# EAGLE design 6502_arduino (EAGLE 9.6.2)
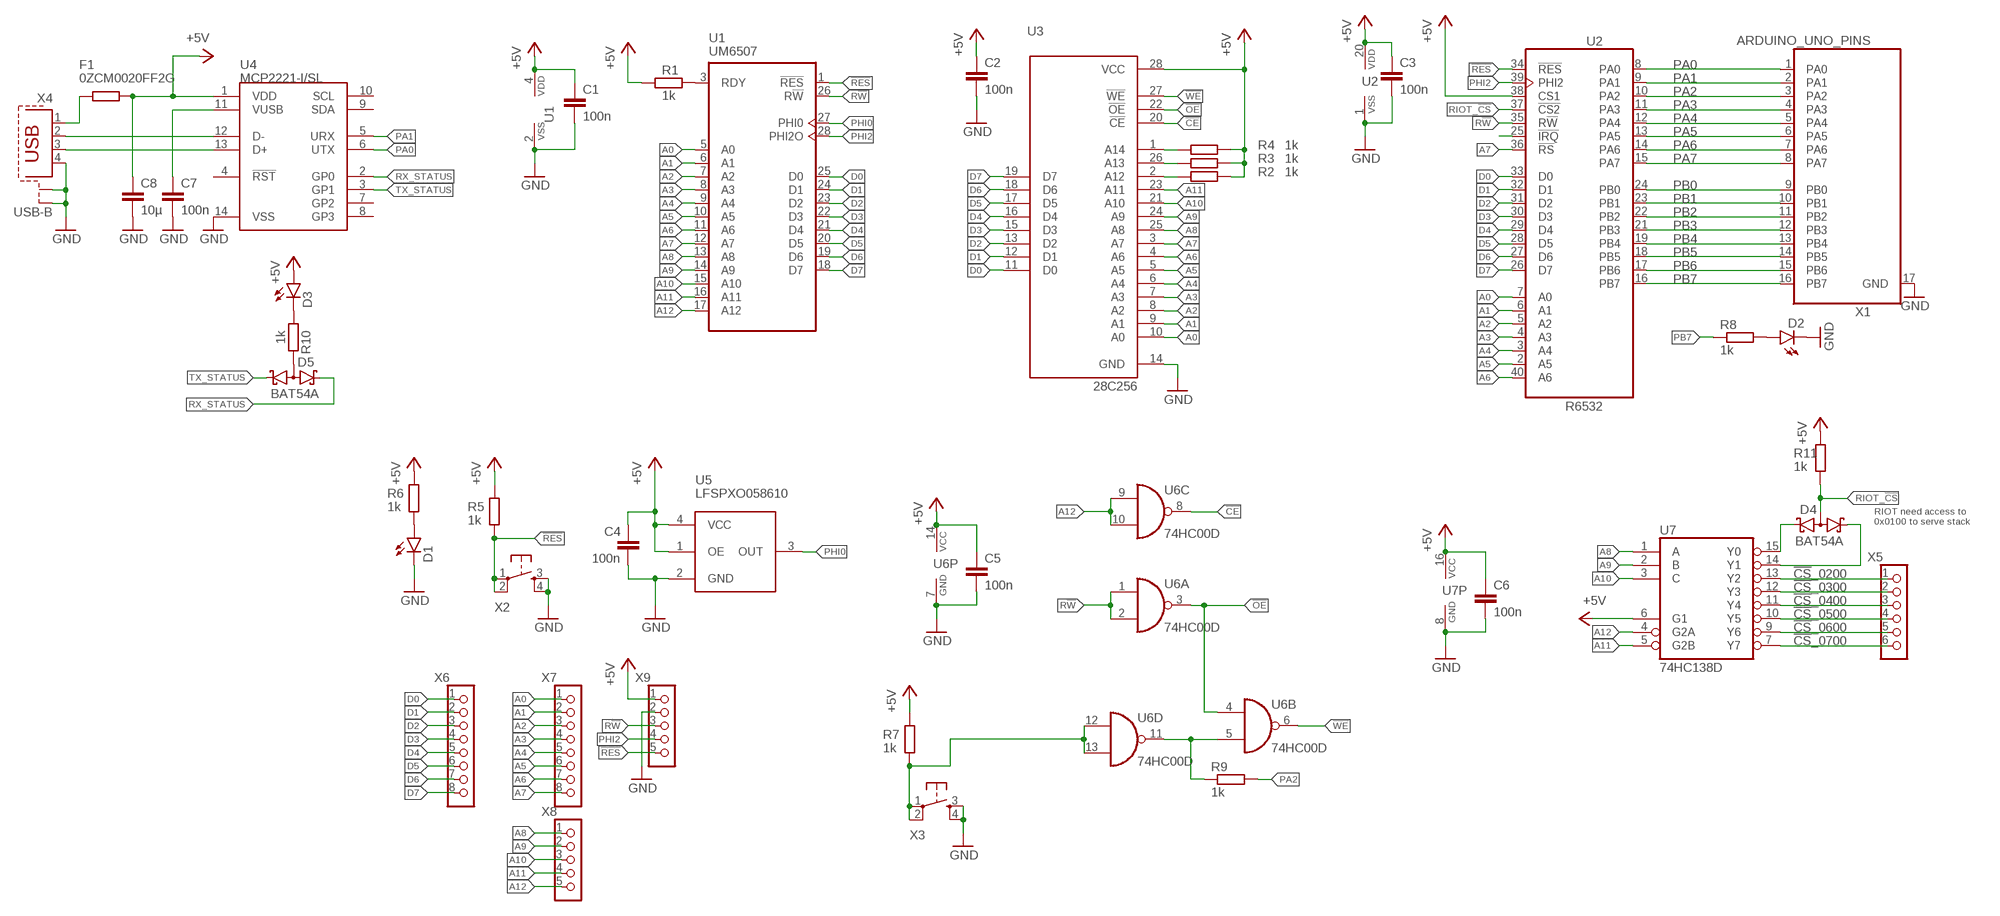
[diagram p0: schematic, sheet 1]

## Parts
C1  100n  C0805  [C0805]
C2  100n  C0805  [C0805]
C3  100n  C0805  [C0805]
C4  100n  C0805  [C0805]
C5  100n  C0805  [C0805]
C6  100n  C0805  [C0805]
C7  100n  C0805  [C0805]
C8  10µ  C0805  [C0805]
D1  LED  [LED3MM]
D2  LED  [LED3MM]
D3  LED  [LED3MM]
D4  BAT54A  [SOT23]
D5  BAT54A  [SOT23]
F1  0ZCM0020FF2G  R-EU_R0603  [R0603]
R1  1k  R0805  [R0805]
R2  1k  R0805  [R0805]
R3  1k  R0805  [R0805]
R4  1k  R0805  [R0805]
R5  1k  R0805  [R0805]
R6  1k  R0805  [R0805]
R7  1k  R0805  [R0805]
R8  1k  R0805  [R0805]
R9  1k  R0805  [R0805]
R10  1k  R0805  [R0805]
R11  1k  R0805  [R0805]
U1  UM6507  [DIL28-6]
U2  R6532  [DIL40]
U3  28C256  [DIL28-6]
U4  MCP2221-I/SL  [SOIC14]
U5  LFSPXO058610  [LFSPXO058610]
U6  74HC00D  [SO14]
U7  74HC138D  [SO16]
X1  ARDUINO_UNO_PINS  [ARDUINO_R3]
X2  TACT_SWITCH  [TACTILE_SWITCH_PTH_6.0MM]
X3  TACT_SWITCH  [TACTILE_SWITCH_PTH_6.0MM]
X4  USB-B  [PN61729-S]
X5  PINHD_6_RND  [1X06]
X6  PINHD_8_RND  [1X08]
X7  PINHD_8_RND  [1X08]
X8  PINHD_5_RND  [1X05]
X9  PINHD_5_RND  [1X05]

## Nets
!BOOT: R7.1 U6.12(D:I0) U6.13(D:I1) X3.1 X3.2
!CE: U3.20(!CE) U6.8(C:O)
!CS!_0200: U7.13(Y2) X5.1
!CS!_0300: U7.12(Y3) X5.2
!CS!_0400: U7.11(Y4) X5.3
!CS!_0500: U7.10(Y5) X5.4
!CS!_0600: U7.9(Y6) X5.5
!CS!_0700: U7.7(Y7) X5.6
!OE: U3.22(!OE) U6.3(A:O) U6.4(B:I0)
!RES: R5.1 U1.1(!RES) U2.34(!RES) X2.1 X2.2 X9.5
!WE: U3.27(!WE) U6.6(B:O)
+5V: C1.1 C2.1 C3.1 C4.1 C5.1 C6.1 C8.1 D3.A F1.2 R1.1 R2.2 R3.2 R4.2 R5.2 R6.2 R7.2 R11.2 U1.4(VDD) U2.20(VDD) U2.38(CS1) U3.28(VCC) U4.1(VDD) U5.1(OE) U5.4(VCC) U6.14(P:VCC) U7.6(G1) U7.16(VCC) X9.1
A0: U1.5(A0) U2.7(A0) U3.10(A0) X7.1
A1: U1.6(A1) U2.6(A1) U3.9(A1) X7.2
A2: U1.7(A2) U2.5(A2) U3.8(A2) X7.3
A3: U1.8(A3) U2.4(A3) U3.7(A3) X7.4
A4: U1.9(A4) U2.3(A4) U3.6(A4) X7.5
A5: U1.10(A5) U2.2(A5) U3.5(A5) X7.6
A6: U1.11(A6) U2.40(A6) U3.4(A6) X7.7
A7: U1.12(A7) U2.36(!RS) U3.3(A7) X7.8
A8: U1.13(A8) U3.25(A8) U7.1(A) X8.1
A9: U1.14(A9) U3.24(A9) U7.2(B) X8.2
A10: U1.15(A10) U3.21(A10) U7.3(C) X8.3
A11: U1.16(A11) U3.23(A11) U7.5(G2B) X8.4
A12: U1.17(A12) U6.9(C:I0) U6.10(C:I1) U7.4(G2A) X8.5
D0: U1.25(D0) U2.33(D0) U3.11(D0) X6.1
D1: U1.24(D1) U2.32(D1) U3.12(D1) X6.2
D2: U1.23(D2) U2.31(D2) U3.13(D2) X6.3
D3: U1.22(D3) U2.30(D3) U3.15(D3) X6.4
D4: U1.21(D4) U2.29(D4) U3.16(D4) X6.5
D5: U1.20(D5) U2.28(D5) U3.17(D5) X6.6
D6: U1.19(D6) U2.27(D6) U3.18(D6) X6.7
D7: U1.18(D7) U2.26(D7) U3.19(D7) X6.8
GND: C1.2 C2.2 C3.2 C4.2 C5.2 C6.2 C7.2 C8.2 D1.K(C) D2.K(C) U1.2(VSS) U2.1(VSS) U3.14(GND) U4.14(VSS) U5.2(GND) U6.7(P:GND) U7.8(GND) X1.17(GND) X2.3 X2.4 X3.3 X3.4 X4.4 X4.S1 X4.S2 X9.2
N$1: R1.2 U1.3(RDY)
N$2: D1.A R6.1
N$3: R9.1 U6.5(B:I1) U6.11(D:O)
N$4: D2.A R8.2
N$5: U4.12(D-) X4.2
N$6: U4.13(D+) X4.3
N$7: U2.25(!IRQ)
N$8: D3.K(C) R10.1
N$9: C7.1 U4.11(VUSB)
N$10: D5.3(AA) R10.2
N$11: F1.1 X4.1
N$13: D4.1(K1) U7.15(Y0)
N$14: R2.1 U3.2(A12)
N$15: R3.1 U3.26(A13)
N$16: R4.1 U3.1(A14)
N$17: D4.2(K2) U7.14(Y1)
PA0: U2.8(PA0) U4.6(UTX) X1.1(PA0)
PA1: U2.9(PA1) U4.5(URX) X1.2(PA1)
PA2: R9.2 U2.10(PA2) X1.3(PA2)
PA3: U2.11(PA3) X1.4(PA3)
PA4: U2.12(PA4) X1.5(PA4)
PA5: U2.13(PA5) X1.6(PA5)
PA6: U2.14(PA6) X1.7(PA6)
PA7: U2.15(PA7) X1.8(PA7)
PB0: U2.24(PB0) X1.9(PB0)
PB1: U2.23(PB1) X1.10(PB1)
PB2: U2.22(PB2) X1.11(PB2)
PB3: U2.21(PB3) X1.12(PB3)
PB4: U2.19(PB4) X1.13(PB4)
PB5: U2.18(PB5) X1.14(PB5)
PB6: U2.17(PB6) X1.15(PB6)
PB7: R8.1 U2.16(PB7) X1.16(PB7)
PHI0: U1.27(PHI0) U5.3(OUT)
PHI2: U1.28(PHI2O) U2.39(PHI2) X9.4
R!W: U1.26(R!W) U2.35(R!W) U6.1(A:I0) U6.2(A:I1) X9.3
RIOT_!CS: D4.3(AA) R11.1 U2.37(!CS2)
RX_STATUS: D5.2(K2) U4.2(GP0)
TX_STATUS: D5.1(K1) U4.3(GP1)
Unconnected: U4.4(!RST) U4.7(GP2) U4.8(GP3) U4.9(SDA) U4.10(SCL)

## Notes on the sheet
- RIOT need access to
  0x0100 to serve stack

## Library data of the parts
C1-C8 = 6502_lib:C0805
D1-D3 = 6502_lib:LED
D4 D5 = diode:BAT54A: Schottky Diodes Source: Fairchild .. BAT54.pdf
F1 = rcl:R-EU_: RESISTOR, European symbol; SPICEPREFIX: R
R1-R11 = 6502_lib:R0805
U1 = 6502_lib:UM6507
U2 = 6502_lib:R6532
U3 = 6502_lib:28C256
U4 = rfr-lib-digital:MCP2221-*: MCP2221 in PDIP, SOIC and TSSOP package The MCP2221 is a USB-to-UART/I2C serial converter which enables USB connectivity in applications that have a UART and I2C interfaces. The device reduces external components by integrating the USB termination resistors and the oscillator needed for USB operation. The MCP2221 also has four GP pins providing miscellaneous functionalities (GPIO, USBCFG, SSPND, Clock Output, ADC, DAC, interrupt detector). Source: www.microchip.com/MCP2221 <http://www.microchip.com/wwwproducts/Devices.aspx?product=MCP2221> and www.microchipdirect.com <http://www.microchipdirect.com/ProductDetails.aspx?Category=MCP2221> Tutorial: MCP2221 by Arnauld Biganzoli <https://docs.google.com/document/d/1P3zzqCKdEXzCe--1Yyg8PClCZKsUri8pyNO7AV2daaw/edit?usp=sharing>
U5 = 6502_lib:LFSPXO058610
U6 = 74xx-eu:74*00: Quad 2-input NAND gate
U7 = 74xx-eu:74*138: 3-line to 8-line DECODER/DEMULTIPLEXER
X1 = 6502_lib:ARDUINO_UNO_PINS
X2 X3 = 6502_lib:TACT_SWITCH
X4 = 6502_lib:USB-B: BERG USB connector; OC_FARNELL: unknown; OC_NEWARK: unknown
X5 = 6502_lib:PINHD_6_RND
X6 X7 = 6502_lib:PINHD_8_RND: PIN HEADER
X8 X9 = 6502_lib:PINHD_5_RND

## Board
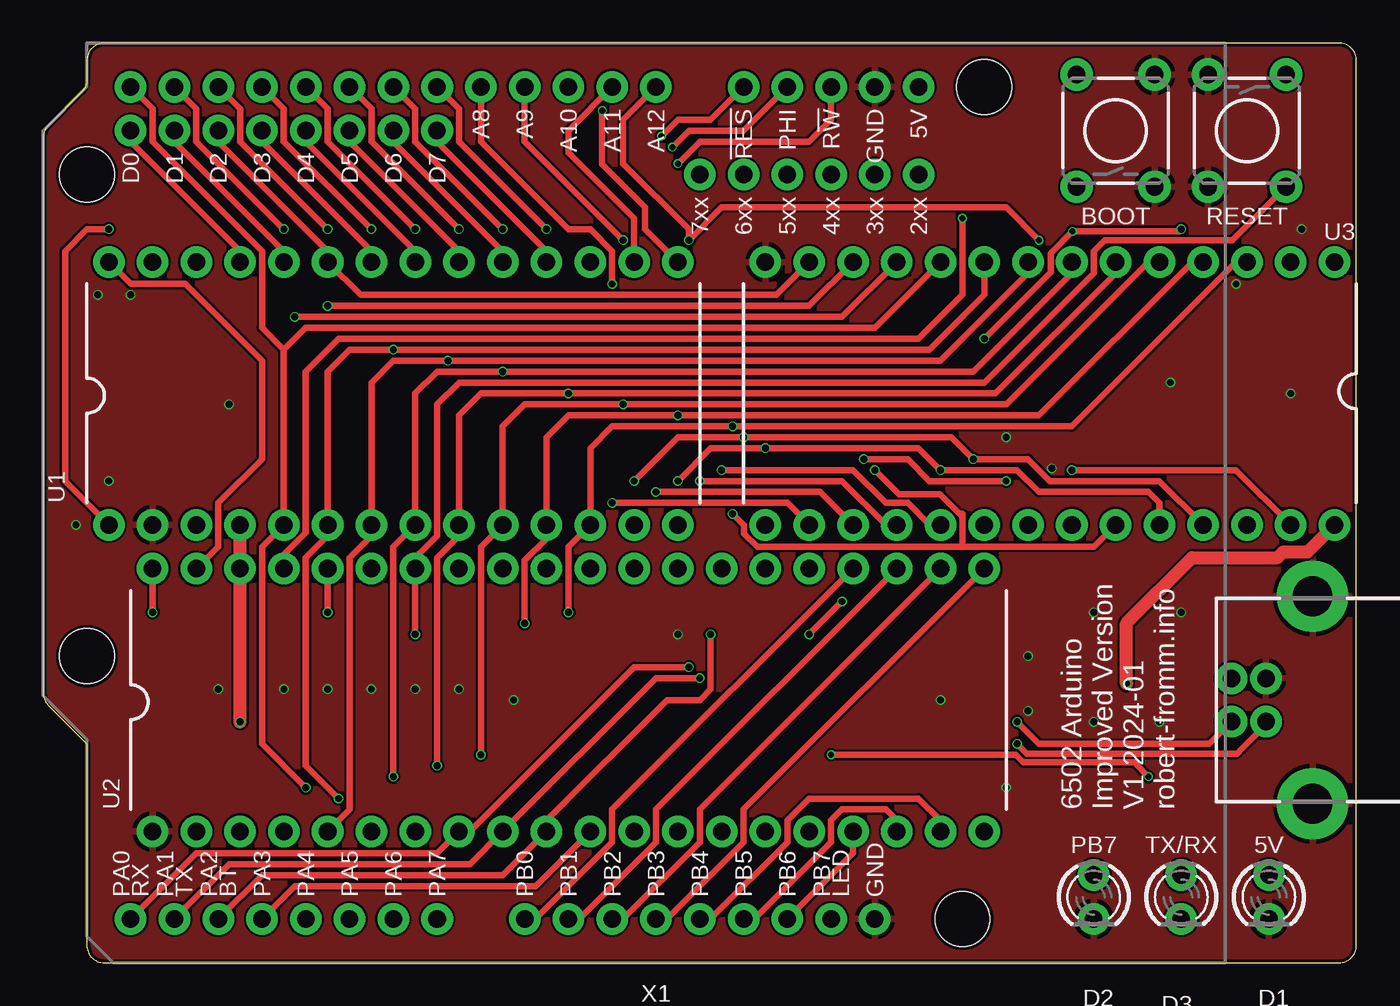
[diagram p1: board, top side]
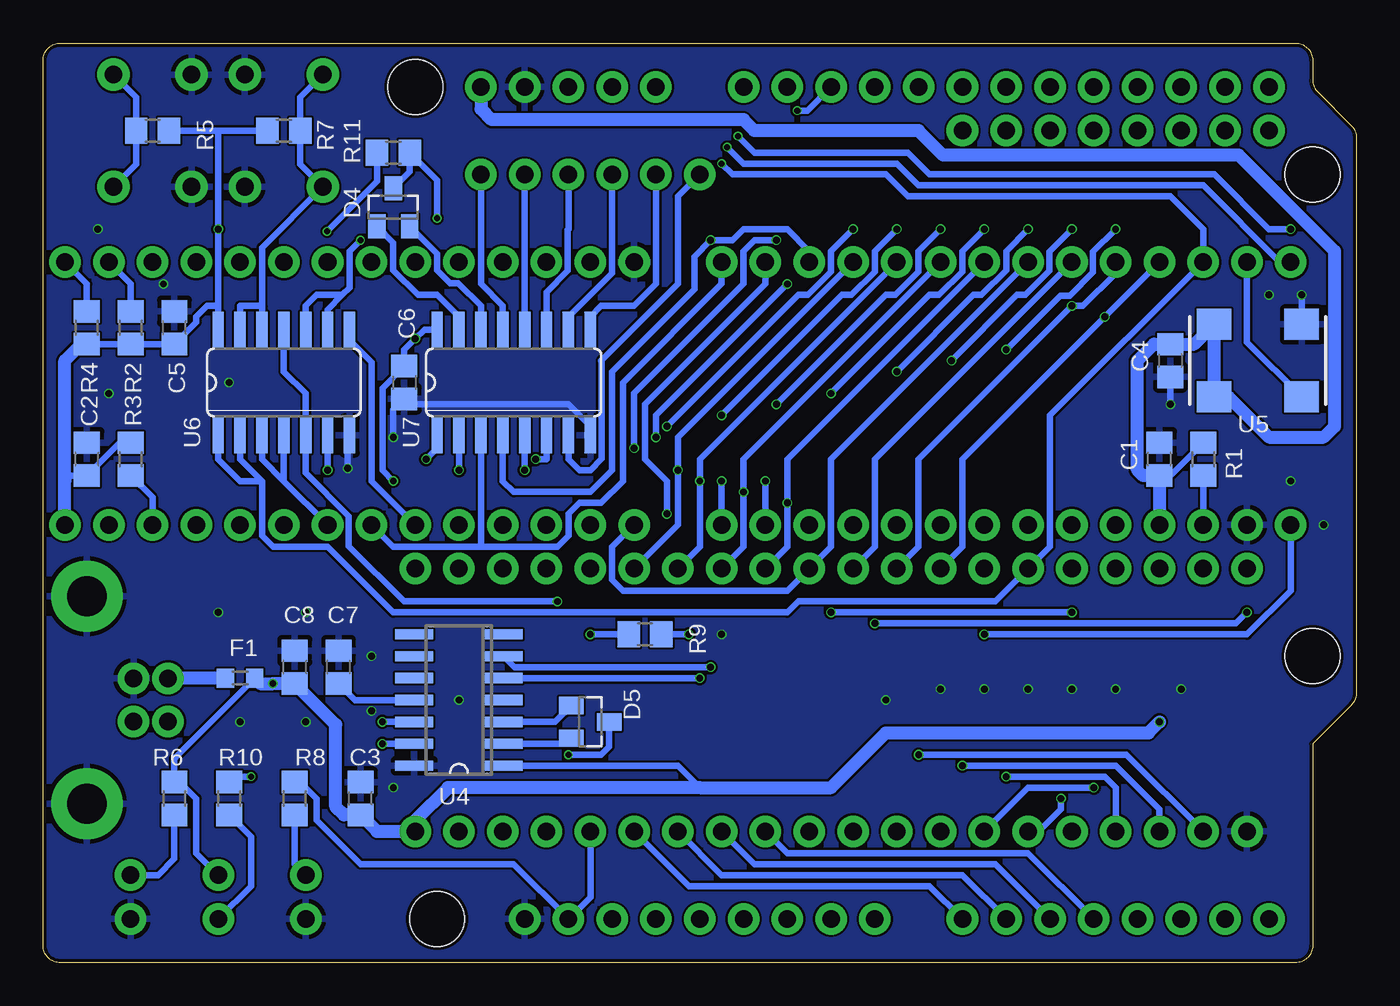
[diagram p2: board, bottom side, seen from below]

Size 76.2 x 53.34 mm. Coordinates in mm from the lower left corner, seen from the top.
Outline: 2.54,12.7 2.54,1 arc90 3.54,0 75.2,0 arc90 76.2,1 76.2,52.34 arc90 75.2,53.34 3.54,53.34 arc90 2.54,52.34 2.54,51.21 arc-45 2.25,50.51 0.29,48.55 arc45 0,47.85 0,15.65 arc45 0.29,14.95 2.54,12.7
Copper layers (1*16): Top 0.035mm / dielectric 1.6mm / Bottom 0.035mm
Design rules "jlcpcb-2layers *": minimum track width 5mil, minimum drill 0.3mm, track to track 5mil, track to pad 5mil, pad to pad 5mil, via to via 5mil, smd to smd 5mil, copper to edge 0.2mm, drill to drill 6mil, minimum pad ring 10mil, minimum via ring 3mil, stop-mask expansion 4mil, vias tented up to drill 0.5mm, thermal gap 10mil

### Footprints (pad centres in the part's own frame; a part is rotated, then mirrored left to right if it is on the bottom)
C0805 = smd 1.3 x 1.5: 1 -0.95,0; 2 0.95,0
LED3MM = drill 1.016 pad 1.778: A -1.27,0; K 1.27,0
SOT23 = smd 1 x 1.4: 1 -0.95,-1.1; 2 0.95,-1.1; 3 0,1.1
R0603 = smd 1 x 1.1: 1 -0.85,0; 2 0.85,0
R0805 = smd 1.3 x 1.5: 1 -0.95,0; 2 0.95,0
DIL28-6 = drill 1.016 pad 1.778: 1 -16.51,-7.62; 2 -13.97,-7.62; 3 -11.43,-7.62; 4 -8.89,-7.62; 5 -6.35,-7.62; 6 -3.81,-7.62; 7 -1.27,-7.62; 8 1.27,-7.62; 9 3.81,-7.62; 10 6.35,-7.62; 11 8.89,-7.62; 12 11.43,-7.62; 13 13.97,-7.62; 14 16.51,-7.62; 15 16.51,7.62; 16 13.97,7.62; 17 11.43,7.62; 18 8.89,7.62; 19 6.35,7.62; 20 3.81,7.62; 21 1.27,7.62; 22 -1.27,7.62; 23 -3.81,7.62; 24 -6.35,7.62; 25 -8.89,7.62; 26 -11.43,7.62; 27 -13.97,7.62; 28 -16.51,7.62
DIL40 = drill 1.016 pad 1.778: 1 -24.13,-7.62; 2 -21.59,-7.62; 3 -19.05,-7.62; 4 -16.51,-7.62; 5 -13.97,-7.62; 6 -11.43,-7.62; 7 -8.89,-7.62; 8 -6.35,-7.62; 9 -3.81,-7.62; 10 -1.27,-7.62; 11 1.27,-7.62; 12 3.81,-7.62; 13 6.35,-7.62; 14 8.89,-7.62; 15 11.43,-7.62; 16 13.97,-7.62; 17 16.51,-7.62; 18 19.05,-7.62; 19 21.59,-7.62; 20 24.13,-7.62; 21 24.13,7.62; 22 21.59,7.62; 23 19.05,7.62; 24 16.51,7.62; 25 13.97,7.62; 26 11.43,7.62; 27 8.89,7.62; 28 6.35,7.62; 29 3.81,7.62; 30 1.27,7.62; 31 -1.27,7.62; 32 -3.81,7.62; 33 -6.35,7.62; 34 -8.89,7.62; 35 -11.43,7.62; 36 -13.97,7.62; 37 -16.51,7.62; 38 -19.05,7.62; 39 -21.59,7.62; 40 -24.13,7.62
SOIC14 = smd 0.6 x 2.2: 1 -3.81,-2.6; 2 -2.54,-2.6; 3 -1.27,-2.6; 4 0,-2.6; 5 1.27,-2.6; 6 2.54,-2.6; 7 3.81,-2.6; 8 3.81,2.6; 9 2.54,2.6; 10 1.27,2.6; 11 0,2.6; 12 -1.27,2.6; 13 -2.54,2.6; 14 -3.81,2.6
LFSPXO058610 = smd 2 x 1.8: 1 -2.54,2.1; 2 2.54,2.1; 3 2.54,-2.1; 4 -2.54,-2.1
SO14 = smd 0.66 x 2.032: 1 -3.81,-3.073; 2 -2.54,-3.073; 3 -1.27,-3.073; 4 0,-3.073; 5 1.27,-3.073; 6 2.54,-3.073; 7 3.81,-3.073; 8 3.81,3.073; 9 2.54,3.073; 10 1.27,3.073; 11 0,3.073; 12 -1.27,3.073; 13 -2.54,3.073; 14 -3.81,3.073
SO16 = smd 0.66 x 2.032: 1 -4.445,-3.073; 2 -3.175,-3.073; 3 -1.905,-3.073; 4 -0.635,-3.073; 5 0.635,-3.073; 6 1.905,-3.073; 7 3.175,-3.073; 8 4.445,-3.073; 9 4.445,3.073; 10 3.175,3.073; 11 1.905,3.073; 12 0.635,3.073; 13 -0.635,3.073; 14 -1.905,3.073; 15 -3.175,3.073; 16 -4.445,3.073
ARDUINO_R3 = drill 1.016 pad 1.778: 1 30.48,24.13; 2 27.94,24.13; 3 25.4,24.13; 4 22.86,24.13; 5 20.32,24.13; 6 17.78,24.13; 7 15.24,24.13; 8 12.7,24.13; 9 7.62,24.13; 10 5.08,24.13; 11 2.54,24.13; 12 0,24.13; 13 -2.54,24.13; 14 -5.08,24.13; 15 -7.62,24.13; 16 -10.16,24.13; 17 -12.7,24.13 | hole 3.175: -17.78,24.13; 33.02,8.89; 33.02,-19.05; -19.05,-24.13
TACTILE_SWITCH_PTH_6.0MM = drill 1.016 pad 1.88: 1 -3.251,2.261; 2 3.251,2.261; 3 -3.251,-2.261; 4 3.251,-2.261
PN61729-S = drill 1.016: 1 1.25,4.71; 2 -1.25,4.71; 3 -1.25,2.71; 4 1.25,2.71 | drill 2.3 pad 2.9: S1 -6.02,0; S2 6.02,0
1X06 = drill 1.016 pad 1.778: 1 -6.35,0; 2 -3.81,0; 3 -1.27,0; 4 1.27,0; 5 3.81,0; 6 6.35,0
1X08 = drill 1.016 pad 1.778: 1 -8.89,0; 2 -6.35,0; 3 -3.81,0; 4 -1.27,0; 5 1.27,0; 6 3.81,0; 7 6.35,0; 8 8.89,0
1X05 = drill 1.016 pad 1.778: 1 -5.08,0; 2 -2.54,0; 3 0,0; 4 2.54,0; 5 5.08,0

### Placement (x,y rotation side)
C1  11.43,29.21 90 bottom
C2  73.66,29.21 90 bottom
C3  57.78,9.53 90 bottom
C4  10.79,34.92 270 bottom
C5  68.58,36.83 90 bottom
C6  55.24,33.66 270 bottom
C7  59.05,17.14 90 bottom
C8  61.59,17.14 90 bottom
D1  71.12,3.81 270 top
D2  60.96,3.81 270 top
D3  66.04,3.81 270 top
D4  55.88,43.81 0 bottom
D5  44.45,13.97 270 bottom
F1  64.77,16.51 0 bottom
R1  8.89,29.21 270 bottom
R2  71.12,36.83 270 bottom
R3  71.12,29.21 90 bottom
R4  73.66,36.83 270 bottom
R5  69.85,48.26 0 bottom
R6  68.58,9.53 90 bottom
R7  62.23,48.26 180 bottom
R8  61.59,9.53 270 bottom
R9  41.27,19.05 0 bottom
R10  65.41,9.53 90 bottom
R11  55.88,46.99 180 bottom
U1  20.32,33.02 0 top
U2  30.48,15.24 0 top
U3  58.42,33.02 180 top
U4  52.07,15.24 90 bottom
U5  5.71,34.92 0 bottom
U6  62.23,33.66 0 bottom
U7  48.9,33.66 0 bottom
X1  35.56,26.67 180 top
X2  69.85,48.26 270 top
X3  62.23,48.26 90 top
X4  73.66,15.24 90 top
X5  44.45,45.72 180 top
X6  13.97,48.26 0 top
X7  13.97,50.8 0 top
X8  30.48,50.8 0 top
X9  45.72,50.8 180 top

### Tracks (layer width: path | path; a pad name or v marks a point on that pad's centre or on a via)
!BOOT
  Bottom 0.381: 63.5,38.1 64.77,38.1 U6.13 | X3.2 61.28,50.2 R7.1 61.28,46.32 X3.1 63.5,41.48 63.5,38.1 | 63.5,38.1 U6.12
!CE
  Bottom 0.381: U6.8 58.42,36.09 57.15,34.82 57.15,27.94 U3.20
!CS!_0200
  Bottom 0.381: U7.13 49.53,38.1 50.8,39.37 X5.1
!CS!_0300
  Bottom 0.381: U7.12 X5.2
!CS!_0400
  Bottom 0.381: U7.11 46.99,38.9 45.76,40.13 45.76,42.51 45.72,42.55 X5.3
!CS!_0500
  Bottom 0.381: U7.10 45.72,37.47 43.18,40.01 X5.4
!CS!_0600
  Bottom 0.381: U7.9 44.45,37.47 43.81,38.1 41.91,38.1 40.64,39.37 X5.5
!CS!_0700
  Bottom 0.381: U7.7 45.72,29.21 45.09,28.57 44.45,28.57 43.8,29.22 43.8,34.91 43.81,34.92 39.37,39.37 39.37,44.45 X5.6
!OE
  Bottom 0.381: U6.4 62.23,27.94 | U3.22 62.23,27.94 | 62.23,27.94 63.5,29.21 U6.3
!RES  (via drill 0.35, 0.4)
  Top 0.381: v21.59,19.05 U2.34 21.59,23.5 22.86,24.77 22.86,32.38 24.13,33.66 54.61,33.66 60.96,40.01 60.96,41.27 61.59,41.91 69.01,41.91 X2.2 | U1.1 1.27,27.94 1.27,41.27 2.54,42.55 v3.81,42.55 | X9.5 38.73,48.9 36.83,48.9 v35.88,47.94
  Bottom 0.381: X2.2 70.8,46.32 R5.1 70.8,50.2 X2.1 | U1.1 3.81,21.59 6.35,19.05 v21.59,19.05 | v3.81,42.55 5.08,42.55 8.26,45.72 24.77,45.72 26.04,46.99 34.92,46.99 v35.88,47.94
!WE  (via drill 0.4)
  Top 0.381: v59.69,28.57 69.22,28.57 U3.27
  Bottom 0.381: U6.6 v59.69,28.57
+5V  (via drill 0.35, 0.4)
  Top 0.381: v66.04,42.55 65.91,42.42 v59.73,42.42 58.46,41.15 58.46,40.04 v54.61,36.2 | v55.88,27.94 51.44,27.94 50.16,29.21 v47.62,29.21
  Top 0.762: v11.43,13.97 U2.38 U1.4 | v62.87,16.2 62.87,19.68 66.67,23.5 71.61,23.5 71.96,23.84 73.37,23.84 U3.28
  Bottom 0.381: U4.1 39.37,11.43 38.1,10.16 | F1.2 68.47,11.96 68.58,11.85 R6.2 68.26,10.47 67.31,9.53 67.31,6.35 D3.A | R3.2 71.76,30.16 C2.1 74.61,28.26 74.93,27.94 | 66.04,38.1 66.67,38.1 67.31,37.47 67.31,37.15 C5.1 R2.2 R4.2 | 66.04,38.1 U6.14 | R7.2 66.04,48.26 | 66.04,48.26 R5.2 | 66.04,48.26 v66.04,42.55 66.04,38.1 | C1.1 10.79,28.26 R1.1 | U7.16 54.08,36.73 v54.61,36.2 55.24,35.56 C6.1 56.52,33.34 56.52,28.57 v55.88,27.94 | v47.62,29.21 46.99,29.21 U7.6 | R11.2 56.83,45.31 v59.73,42.42
  Bottom 0.762: F1.2 63.6,16.2 v62.87,16.2 C8.1 59.21,13.81 59.21,9.05 58.74,8.57 C3.1 56.83,7.62 U2.20 54.61,8.26 52.7,10.16 38.1,10.16 30.48,10.16 27.3,13.34 12.06,13.34 v11.43,13.97 | U1.4 C1.1 12.38,28.26 12.7,28.57 12.7,34.92 11.75,35.88 C4.1 9.4,35.88 U5.1 U5.4 7.42,32.83 5.08,30.48 1.91,30.48 1.27,31.11 1.27,41.27 6.83,46.84 23.98,46.84 25.4,48.26 34.92,48.26 35.56,48.9 50.16,48.9 50.8,49.53 X9.1 | U3.28 74.93,27.94 74.93,34.92 73.97,35.88 R4.2
A0  (via drill 0.4)
  Top 0.381: v15.24,10.16 12.7,12.7 12.7,24.13 U1.5 13.97,35.56 | 13.97,35.56 15.24,36.83 48.26,36.83 U3.10 | X7.1 6.35,49.53 6.35,47.62 12.7,41.27 12.7,36.83 13.97,35.56
  Bottom 0.381: U2.7 19.05,10.16 v15.24,10.16
A1  (via drill 0.4)
  Top 0.381: v17.14,9.53 15.24,11.43 15.24,23.5 16.51,24.77 U1.6 16.51,34.29 17.78,35.56 v20.32,35.56 51.44,35.56 54.61,38.73 U3.9 | X7.2 8.89,49.53 8.89,47.62 v13.97,42.55
  Bottom 0.381: v17.14,9.53 17.14,8.89 18.41,7.62 U2.6 | v13.97,42.55 15.28,41.24 15.28,40.05 16.64,38.69 17.19,38.69 v20.32,35.56
A2  (via drill 0.4)
  Top 0.381: U2.5 17.78,8.89 17.78,23.5 19.05,24.77 U1.7 19.05,33.66 20.32,34.92 v23.5,34.92 52.07,34.92 57.15,40.01 U3.8 | X7.3 11.43,49.53 11.43,47.62 v16.51,42.55
  Bottom 0.381: v16.51,42.55 17.82,41.24 17.82,40.13 19.21,38.73 19.68,38.73 v23.5,34.92
A3  (via drill 0.4)
  Top 0.381: v20.32,10.79 20.32,24.13 U1.8 21.59,33.02 22.86,34.29 v26.67,34.29 53.98,34.29 55.24,35.56 59.69,40.01 U3.7 | X7.4 13.97,49.53 13.97,47.62 v19.05,42.55
  Bottom 0.381: U2.4 13.97,10.16 14.61,10.79 v20.32,10.79 | v19.05,42.55 20.32,41.27 20.32,40.17 21.75,38.73 22.23,38.73 v26.67,34.29
A4  (via drill 0.4)
  Top 0.381: v22.86,11.43 22.86,23.5 24.13,24.77 U1.9 24.13,31.75 25.4,33.02 v30.48,33.02 55.24,33.02 62.23,40.01 U3.6 | X7.5 16.51,49.53 16.51,47.62 v21.59,42.55
  Bottom 0.381: U2.3 11.43,8.89 13.97,11.43 v22.86,11.43 | v21.59,42.55 22.86,41.27 22.86,40.09 24.21,38.73 24.77,38.73 v30.48,33.02
A5  (via drill 0.4)
  Top 0.381: v25.4,12.06 25.4,24.13 U1.10 26.67,31.11 27.94,32.38 v33.66,32.38 55.88,32.38 64.14,40.64 U3.5 | X7.6 19.05,49.53 19.05,47.62 v24.13,42.55
  Bottom 0.381: U2.2 13.34,12.06 v25.4,12.06 | v24.13,42.55 25.4,41.27 25.4,40.09 26.75,38.73 27.3,38.73 v33.66,32.38
A6  (via drill 0.4)
  Top 0.381: v27.94,19.68 27.94,23.33 29.21,24.6 U1.11 29.21,30.48 30.48,31.75 v36.83,31.75 57.78,31.75 66.67,40.64 U3.4 | v6.35,20.32 U2.40 | X7.7 21.59,49.53 21.59,47.62 v26.67,42.55
  Bottom 0.381: v27.94,19.68 6.99,19.68 v6.35,20.32 | v26.67,42.55 27.94,41.27 27.94,40.09 29.29,38.73 29.84,38.73 v36.83,31.75
A7  (via drill 0.4)
  Top 0.381: U3.3 69.22,40.64 59.69,31.11 v40.01,31.11 33.02,31.11 31.75,29.84 U1.12 30.48,24.13 v30.48,20.32 | U2.36 v16.51,20.32 | X7.8 24.13,49.53 24.13,47.62 v29.21,42.55
  Bottom 0.381: v16.51,20.32 v30.48,20.32 | v29.21,42.55 30.48,41.27 30.48,40.09 31.83,38.73 32.38,38.73 v40.01,31.11
A8  (via drill 0.4)
  Top 0.381: U3.25 64.77,27.94 58.42,27.94 57.15,29.21 v53.98,29.21 52.7,30.48 v40.64,30.48 36.83,30.48 v34.29,27.94 | X8.1 25.4,47.62 30.48,42.55 31.75,42.55 33.02,41.27 v33.02,39.37
  Bottom 0.381: v34.29,27.94 U1.13 | U7.1 53.34,29.84 v53.98,29.21 | v33.02,39.37 40.64,31.75 v40.64,30.48
A9  (via drill 0.4)
  Top 0.381: U3.24 64.77,26.67 64.14,27.3 57.78,27.3 56.52,28.57 v52.07,28.57 50.8,29.84 v41.91,29.84 38.73,29.84 v36.83,27.94 | X8.2 27.94,47.62 v33.66,41.91
  Bottom 0.381: v36.83,27.94 U1.14 | U7.2 v52.07,28.57 | v33.66,41.91 34.92,41.91 35.56,41.27 35.56,39.37 41.91,33.02 v41.91,29.84
A10  (via drill 0.35)
  Top 0.381: U1.15 34.92,42.55 34.92,43.81 32.43,46.31 32.43,49.49 32.45,49.47 v32.45,49.42
  Bottom 0.381: U3.21 55.88,24.13 50.8,24.13 | 50.8,24.13 46.35,24.13 45.72,24.77 45.72,26.04 45.09,26.67 43.81,26.67 42.55,27.94 42.55,33.66 36.83,39.37 U1.15 | U7.3 50.8,24.13 | v32.45,49.42 31.86,49.42 X8.3
A11  (via drill 0.4)
  Top 0.381: U1.16 34.29,43.18 30.48,46.99 30.48,48.26 X8.4 | U3.23 60.96,24.13 53.34,24.13 | v40.01,26.04 40.68,25.36 40.68,24.89 41.44,24.13 53.34,24.13 | 53.34,24.13 53.34,26.04 53.18,26.04 52.03,27.18 49.66,27.18 v48.26,28.57
  Bottom 0.381: U1.16 34.29,39.37 41.27,32.38 41.27,29.21 40.01,27.94 v40.01,26.04 | U7.5 v48.26,28.57
A12  (via drill 0.35, 0.4)
  Top 0.381: v57.78,41.91 55.88,43.81 39.37,43.81 v37.47,41.91 37.47,42.55 33.66,46.35 33.66,48.9 X8.5
  Bottom 0.381: U6.9 59.7,36.74 59.7,37.88 58.84,38.73 | U6.10 60.96,38.1 60.33,38.73 58.84,38.73 | U7.4 49.53,27.94 48.9,27.3 44.45,27.3 43.18,28.57 43.18,34.29 38.42,39.05 38.42,40.96 v37.47,41.91 36.2,41.91 35.56,42.55 33.02,42.55 31.75,41.27 U1.17 | v57.78,41.91 58.42,41.27 58.42,39.16 58.84,38.73
D0  (via drill 0.4)
  Top 0.381: U3.11 46.35,37.47 v14.61,37.47 | X6.1 5.08,47.62 11.43,41.27 U1.25
  Bottom 0.381: U1.25 v14.61,37.47 22.86,29.21 22.86,24.13 U2.33
D1  (via drill 0.4)
  Top 0.381: U3.12 44.45,38.1 v16.51,38.1 | X6.2 7.62,47.62 13.97,41.27 U1.24
  Bottom 0.381: U1.24 13.97,40.01 15.88,38.1 v16.51,38.1 25.4,29.21 25.4,24.13 U2.32
D2
  Top 0.381: U3.13 42.55,38.73 18.41,38.73 U1.23 16.51,41.27 10.16,47.62 X6.3
  Bottom 0.381: U1.23 27.94,29.21 27.94,24.13 U2.31
D3
  Top 0.381: X6.4 12.7,47.62 19.05,41.27 U1.22
  Bottom 0.381: U1.22 30.48,29.21 30.48,24.13 U2.30 33.02,21.59 42.55,21.59 43.18,22.23 43.18,24.13 U3.15
D4  (via drill 0.4)
  Top 0.381: U3.16 43.18,26.67 v33.02,26.67 | X6.5 15.24,47.62 21.59,41.27 U1.21
  Bottom 0.381: U1.21 33.02,29.21 v33.02,26.67 33.02,24.13 U2.29
D5  (via drill 0.4)
  Top 0.381: U3.17 45.09,27.3 v35.56,27.3 | X6.6 17.78,47.62 24.13,41.27 U1.20
  Bottom 0.381: U1.20 35.56,29.21 v35.56,27.3 35.56,24.13 U2.28
D6  (via drill 0.4)
  Top 0.381: U3.18 48.9,25.4 46.35,27.94 v38.1,27.94 | X6.7 20.32,47.62 26.67,41.27 U1.19
  Bottom 0.381: U1.19 38.1,29.21 v38.1,27.94 38.1,24.13 U2.27
D7  (via drill 0.4)
  Top 0.381: U3.19 51.44,25.4 50.16,26.67 48.9,26.67 46.99,28.57 v39.37,28.57 | X6.8 22.86,47.62 29.21,41.27 U1.18
  Bottom 0.381: U2.26 39.37,25.4 v39.37,28.57 39.37,30.48 U1.18
GND  (via drill 0.4)
  Bottom 0.381: v55.88,30.48 55.88,32.07 C6.2 54.92,32.38 45.72,32.38 44.45,31.11 U7.8 | U6.7 58.52,30.48 v58.52,28.68 | C4.2 v10.79,32.38 | U5.2 v3.17,38.73
  other vias: 66.04,20.32 60.96,20.32 72.39,33.02 65.41,33.66 69.22,39.37 73.03,42.55 57.15,17.78 36.83,19.05 27.3,15.24 24.13,15.88 21.59,15.88 19.05,15.88 16.51,15.88 13.97,15.88 10.16,15.88 1.91,25.4 3.81,27.94 5.08,38.73 60.96,13.97 64.77,13.97 57.15,14.61 55.88,10.16 52.07,15.24
  pour Top: -1.27,54.61 77.47,54.61 77.47,-1.27 -1.27,-1.27
  pour Bottom: 77.47,54.61 -1.27,54.61 -1.27,-1.27 77.47,-1.27
N$1
  Bottom 0.381: R1.2 U1.3
N$2
  Bottom 0.381: D1.A 69.53,5.08 68.58,6.04 R6.1
N$3  (via drill 0.4)
  Top 0.381: v44.45,19.05 v46.35,20.95
  Bottom 0.381: U6.11 62.23,34.29 60.96,33.02 U6.5 60.96,28.41 58.46,25.91 58.46,24.17 55.24,20.95 v46.35,20.95 | R9.1 v44.45,19.05
N$4
  Bottom 0.381: R8.2 61.59,5.71 D2.A
N$5  (via drill 0.4)
  Top 0.381: X4.2 67.66,12.7 57.78,12.7 v56.52,13.97
  Bottom 0.381: U4.12 v56.52,13.97
N$6  (via drill 0.4)
  Top 0.381: X4.3 70.95,13.8 69.53,12.38 69.28,12.13 57.09,12.13 v56.52,12.7
  Bottom 0.381: U4.13 v56.52,12.7
N$8
  Bottom 0.381: R10.1 64.14,7.3 64.14,4.45 D3.K
N$9
  Bottom 0.381: U4.11 58.1,15.24 C7.1
N$10  (via drill 0.35)
  Top 0.381: v45.72,12.06 56.43,12.06 56.88,11.62 63.31,11.62 v64.14,10.79
  Bottom 0.381: D5.3 43.35,12.53 43.81,12.06 v45.72,12.06 | v64.14,10.79 65.08,10.79 R10.2
N$11
  Bottom 0.762: F1.1 68.93,16.51 X4.1
N$13
  Bottom 0.381: D4.1 55.88,41.77 55.88,40.17 54.45,38.73 53.34,38.73 52.07,37.47 U7.15
N$14
  Bottom 0.381: R2.1 71.12,39.37 U3.2
N$15
  Bottom 0.381: R3.1 69.85,26.99 U3.26
N$16
  Bottom 0.381: R4.1 73.66,39.37 U3.1
N$17
  Bottom 0.381: D4.2 53.34,41.12 53.34,40.17 52.58,39.41 52.11,39.41 50.8,38.1 U7.14
PA0  (via drill 0.4)
  Top 0.381: X1.1 8.89,6.35 22.86,6.35 U2.8 24.77,7.62 34.29,17.14 v37.47,17.14
  Bottom 0.381: U4.6 48.84,17.14 v37.47,17.14
PA1  (via drill 0.4)
  Top 0.381: X1.2 10.79,5.71 24.77,5.71 U2.9 35.56,16.51 v38.1,16.51
  Bottom 0.381: U4.5 v38.1,16.51
PA2  (via drill 0.4)
  Top 0.381: X1.3 12.7,5.08 26.67,5.08 U2.10 29.21,8.26 36.2,15.24 38.1,15.24 38.73,15.88 v38.73,19.05
  Bottom 0.381: v38.73,19.05 R9.2
PA3
  Top 0.381: U2.11 28.57,4.45 14.61,4.45 X1.4
PA4
  Bottom 0.381: U2.12 33.02,6.35 19.05,6.35 X1.5
PA5
  Bottom 0.381: U2.13 34.92,5.71 20.95,5.71 X1.6
PA6
  Bottom 0.381: U2.14 36.83,5.08 22.86,5.08 X1.7
PA7
  Bottom 0.381: U2.15 38.73,4.45 24.77,4.45 X1.8
PB0
  Top 0.381: X1.9 28.57,2.54 33.02,6.99 33.02,8.89 U2.24
PB1
  Top 0.381: X1.10 31.11,2.54 35.56,6.99 35.56,8.89 U2.23
PB2
  Top 0.381: X1.11 33.66,2.54 38.1,6.99 38.1,8.89 U2.22
PB3
  Top 0.381: X1.12 36.2,2.54 40.64,6.99 40.64,8.89 U2.21
PB4
  Top 0.381: X1.13 38.73,2.54 43.18,6.99 43.18,8.26 44.45,9.53 50.8,9.53 52.07,8.26 U2.19
PB5
  Top 0.381: X1.14 41.27,2.54 45.72,6.99 45.72,8.26 46.35,8.89 48.9,8.89 49.53,8.26 U2.18
PB6
  Top 0.381: X1.15 46.99,6.35 U2.17
PB7
  Bottom 0.381: U2.16 44.45,3.81 X1.16 48.9,5.71 57.78,5.71 60.33,8.26 60.33,9.53 61.27,10.47 R8.1
PHI0
  Bottom 0.381: U5.3 6.35,36 U1.27
PHI2  (via drill 0.35)
  Top 0.381: U2.39 10.16,24.13 10.16,26.67 12.7,29.21 12.7,34.92 8.26,39.37 5.08,39.37 U1.28 | v36.51,47.31 37.47,48.26 40.64,48.26 X9.4
  Bottom 0.381: U1.28 4.45,40.64 8.89,45.09 25.4,45.09 26.67,46.35 35.56,46.35 v36.51,47.31
R!W  (via drill 0.35)
  Top 0.381: X9.3 45.72,48.9 44.45,47.62 38.1,47.62 v36.83,46.35
  Bottom 0.381: U6.2 64.77,29.21 63.5,27.94 | U6.1 66.04,29.21 64.77,27.94 63.5,27.94 | 63.5,27.94 63.5,24.77 62.87,24.13 59.69,24.13 55.88,20.32 33.02,20.32 32.38,20.95 20.95,20.95 U2.35 17.78,24.13 17.78,31.75 U1.26 8.89,42.55 10.79,44.45 26.04,44.45 27.3,45.72 36.2,45.72 v36.83,46.35
RIOT_!CS  (via drill 0.35)
  Top 0.381: U2.37 13.97,23.66 15.24,24.93 15.24,34.29 17.14,36.2 50.8,36.2 53.34,38.73 v53.34,43.18
  Bottom 0.381: v53.34,43.18 53.34,45.4 R11.1 54.93,45.87 D4.3
RX_STATUS
  Bottom 0.381: U4.2 45.87,12.7 D5.2
TX_STATUS
  Bottom 0.381: U4.3 46.5,13.97 D5.1

### Text on the board
tPlace: A8 | A9 | A10 | A11 | A12 | !RES | PHI | R!W | GND | 5V | D0 | D1 | D2 | D3 | D4 | D5 | D6 | D7 | 7xx | 6xx | 5xx | 4xx | 3xx | 2xx | BOOT | RESET | 6502 Arduino / Improved Version / V1 2024-01 / robert-fromm.info | PB7 | TX/RX | 5V | PA0 / RX | PA1 / TX | PA2 / BT | PA3 | PA4 | PA5 | PA6 | PA7 | PB0 | PB1 | PB2 | PB3 | PB4 | PB5 | PB6 | PB7 / LED | GND